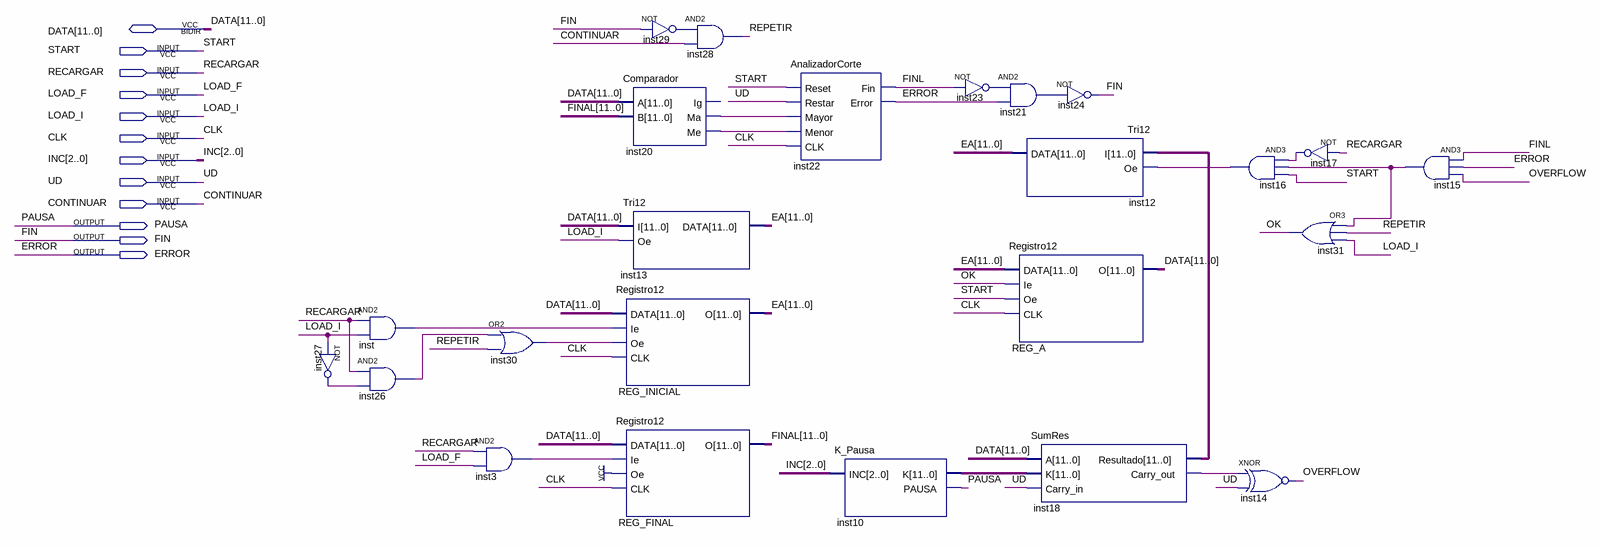
[diagram p0: schematic sheet]
// Quartus schematic PruebaPrincipal2.bdf as structural Verilog: 24 symbols, 12 pins
module PruebaPrincipal2 (
  input  START,
  input  RECARGAR,
  input  LOAD_F,
  input  LOAD_I,
  input  CLK,
  input  [2:0] INC,
  input  UD,
  input  CONTINUAR,
  inout  [11:0] DATA,
  output PAUSA,
  output FIN,
  output ERROR
);

  wire FINL, inst3_out, inst15_out, inst16_out, inst17_out, inst18_carry_out, inst20_ma, inst20_me,
       inst21_out, inst23_out, inst26_out, inst27_out, inst29_out, inst30_out, inst_out, OK, OVERFLOW,
       REPETIR;
  wire [11:0] EA, FINAL, inst10_k, inst18_resultado;

  and inst (inst_out, RECARGAR, LOAD_I);
  not inst27 (inst27_out, LOAD_I);
  and inst26 (inst26_out, RECARGAR, inst27_out);
  and inst3 (inst3_out, RECARGAR, LOAD_F);
  or inst30 (inst30_out, inst26_out, REPETIR);
  not inst29 (inst29_out, FIN);
  Comparador inst20 (.A(DATA), .B(FINAL), .Ma(inst20_ma), .Me(inst20_me));  // open: Ig
  Tri12 inst13 (.I(DATA), .Oe(LOAD_I), .DATA(EA));
  Registro12 REG_INICIAL (.DATA(DATA), .Ie(inst_out), .Oe(inst30_out), .CLK(CLK), .O(EA));
  Registro12 REG_FINAL (.DATA(DATA), .Ie(inst3_out), .Oe(1'b1), .CLK(CLK), .O(FINAL));
  and inst28 (REPETIR, inst29_out, CONTINUAR);
  AnalizadorCorte inst22 (
    .Reset(START), .Restar(UD), .Mayor(inst20_ma), .Menor(inst20_me), .CLK(CLK), .Fin(FINL), .Error(ERROR));
  K_Pausa inst10 (.INC(INC), .K(inst10_k), .PAUSA(PAUSA));
  and inst21 (inst21_out, inst23_out, ERROR);
  not inst23 (inst23_out, FINL);
  not inst24 (FIN, inst21_out);
  Tri12 inst12 (.I(inst18_resultado), .Oe(inst16_out), .DATA(EA));
  Registro12 REG_A (.DATA(EA), .Ie(OK), .Oe(START), .CLK(CLK), .O(DATA));
  SumRes inst18 (.A(DATA), .K(inst10_k), .Carry_in(UD), .Resultado(inst18_resultado), .Carry_out(inst18_carry_out));
  and inst16 (inst16_out, inst17_out, inst15_out, START);
  or inst31 (OK, inst15_out, REPETIR, LOAD_I);
  xnor inst14 (OVERFLOW, inst18_carry_out, UD);
  not inst17 (inst17_out, RECARGAR);
  and inst15 (inst15_out, FINL, ERROR, OVERFLOW);
endmodule
